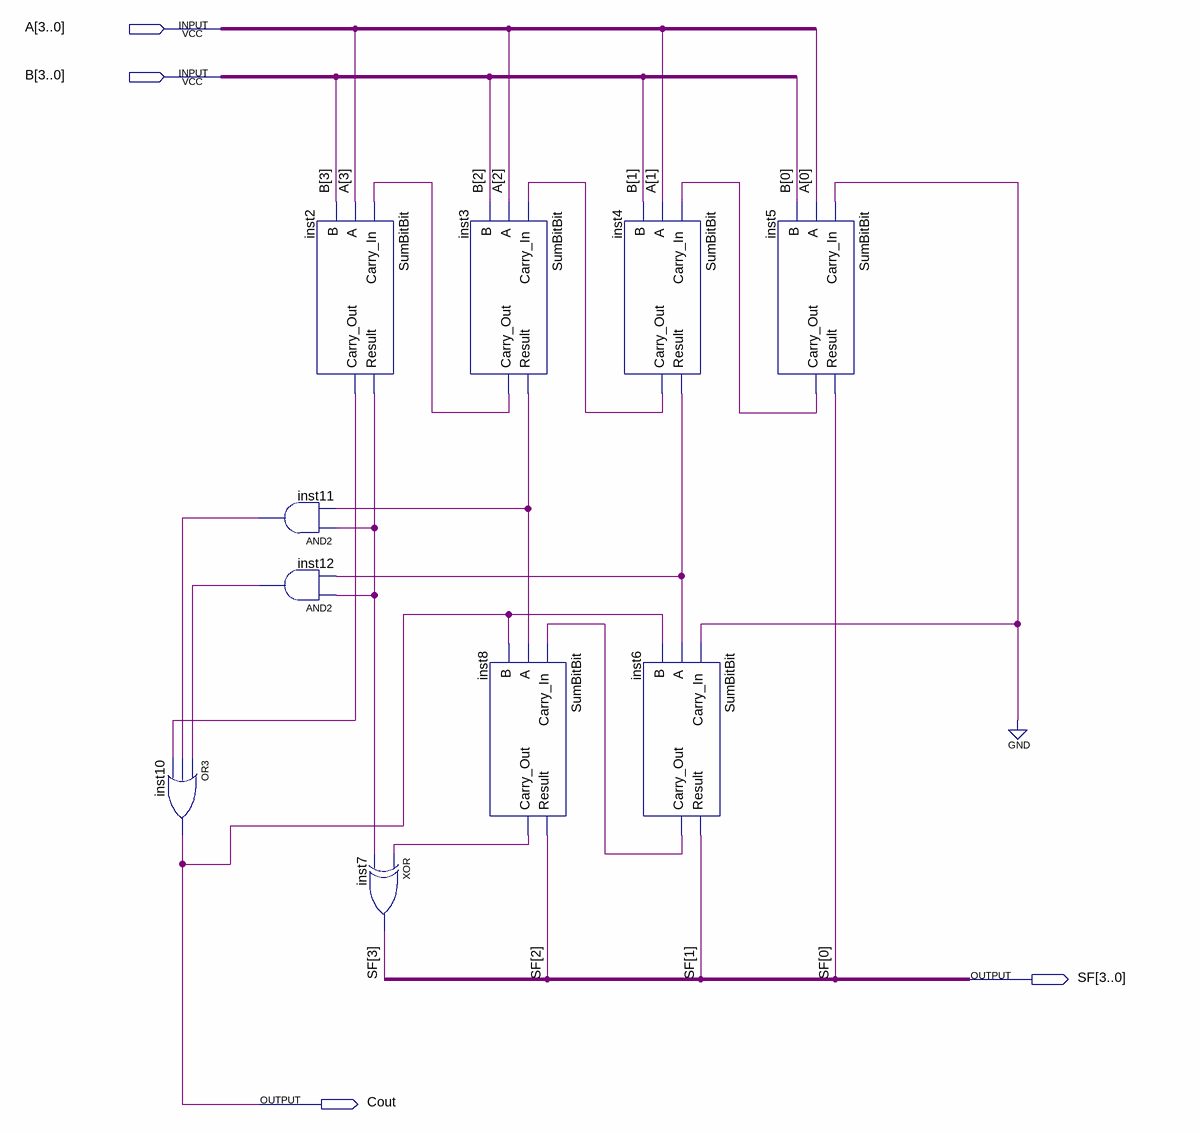
[diagram p0: schematic sheet]
// Quartus schematic Somador_BCD_2Dig.bdf as structural Verilog: 10 symbols, 4 pins
module Somador_BCD_2Dig (
  input  [3:0] A,
  input  [3:0] B,
  output [3:0] SF,
  output Cout
);

  wire inst2_carry_out, inst2_result, inst3_carry_out, inst3_result, inst4_carry_out, inst4_result,
       inst5_carry_out, inst6_carry_out, inst8_carry_out, inst11_out, inst12_out;

  or inst10 (Cout, inst12_out, inst11_out, inst2_carry_out);
  and inst11 (inst11_out, inst2_result, inst3_result);
  and inst12 (inst12_out, inst2_result, inst4_result);
  SumBitBit inst2 (.Carry_In(inst3_carry_out), .A(A[3]), .B(B[3]), .Result(inst2_result), .Carry_Out(inst2_carry_out));
  xor inst7 (SF[3], inst8_carry_out, inst2_result);
  SumBitBit inst3 (.Carry_In(inst4_carry_out), .A(A[2]), .B(B[2]), .Result(inst3_result), .Carry_Out(inst3_carry_out));
  SumBitBit inst8 (.Carry_In(inst6_carry_out), .A(inst3_result), .B(Cout), .Result(SF[2]), .Carry_Out(inst8_carry_out));
  SumBitBit inst4 (.Carry_In(inst5_carry_out), .A(A[1]), .B(B[1]), .Result(inst4_result), .Carry_Out(inst4_carry_out));
  SumBitBit inst6 (.Carry_In(1'b0), .A(inst4_result), .B(Cout), .Result(SF[1]), .Carry_Out(inst6_carry_out));
  SumBitBit inst5 (.Carry_In(1'b0), .A(A[0]), .B(B[0]), .Result(SF[0]), .Carry_Out(inst5_carry_out));
endmodule
